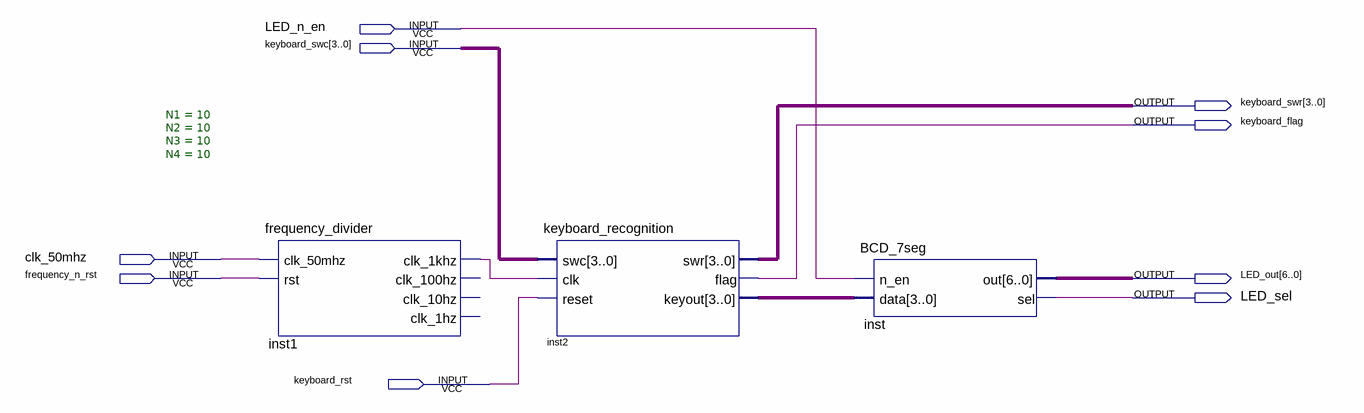
[diagram p0: schematic sheet]
// Quartus schematic keyboard_recognition_top.bdf as structural Verilog: 3 symbols, 9 pins
module keyboard_recognition_top (
  input  LED_n_en,
  input  [3:0] keyboard_swc,
  input  clk_50mhz,
  input  frequency_n_rst,
  input  keyboard_rst,
  output [3:0] keyboard_swr,
  output keyboard_flag,
  output [6:0] LED_out,
  output LED_sel
);

  wire inst1_clk_1khz;
  wire [3:0] inst2_keyout;

  frequency_divider #(.N1(10), .N2(10), .N3(10), .N4(10)) inst1 (
    .clk_50mhz(clk_50mhz), .rst(frequency_n_rst), .clk_1khz(inst1_clk_1khz));  // open: clk_100hz, clk_10hz, clk_1hz
  keyboard_recognition inst2 (
    .swc(keyboard_swc), .clk(inst1_clk_1khz), .reset(keyboard_rst), .swr(keyboard_swr), .flag(keyboard_flag),
    .keyout(inst2_keyout));
  BCD_7seg inst (.n_en(LED_n_en), .data(inst2_keyout), .out(LED_out), .sel(LED_sel));
endmodule
